# Altium schematic sheet MOSFET_V2.SchDoc
size A4; SheetNumber: 3; SheetTotal: 4
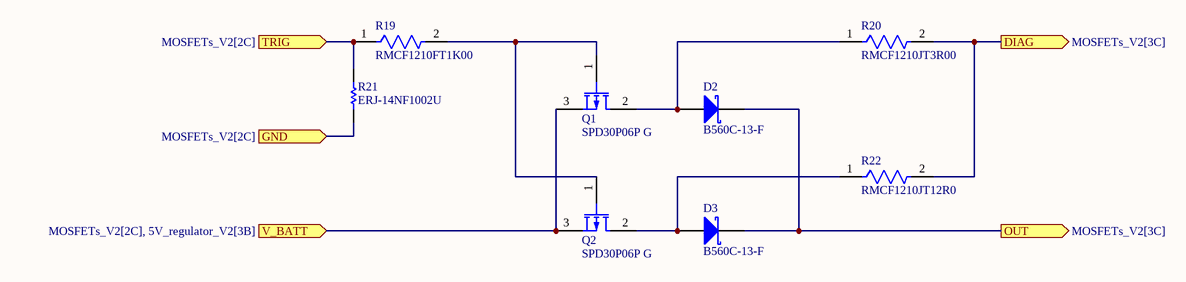
[diagram p0: MOSFET_V2.SchDoc]

## Parts
D2  B560C-13-F  [DIOD-B5X0C-2_M]
D3  B560C-13-F  [DIOD-B5X0C-2_M]
Q1  SPD30P06P G  [INF-PG-TO252-3-1_N]
Q2  SPD30P06P G  [INF-PG-TO252-3-1_N]
R19  RMCF1210FT1K00  [FP-RMCF1210-IPC_A]
R20  RMCF1210JT3R00  [FP-RMCF1210-IPC_A]
R21  ERJ-14NF1002U  [RESC3225X70X50NL20T20]
R22  RMCF1210JT12R0  [FP-RMCF1210-IPC_B]

## Ports
DIAG (out, see MOSFETs_V2[3C]), GND (in, see MOSFETs_V2[2C]), OUT (out, see MOSFETs_V2[3C]), TRIG (in, see MOSFETs_V2[2C]), V_BATT (in, see MOSFETs_V2[2C], 5V_regulator_V2[3B])

## Nets
DIAG: R20.2 R22.2 ; port DIAG
GND: R21.2 ; port GND
OUT: D2.1(K) D3.1(K) ; port OUT
TRIG: R19.1 R21.1 ; port TRIG
V_BATT: Q1.3(S) Q2.3(S) ; port V_BATT
NetD2_2: D2.2(A) Q1.2(D) R20.1
NetD3_2: D3.2(A) Q2.2(D) R22.1
NetQ1_1: Q1.1(G) Q2.1(G) R19.2

## Library data of the parts
D2 D3 = CMP-2000-05098-2: Schottky Barrier Rectifier, 5 A, 60 V, -55 to 125 degC, 2-Pin SMD, RoHS, Tape and Reel; Ir - Reverse Current: 500uA; Configuration: Single; Ifsm - Forward Surge Current: 100A; Vrrm - Repetitive Reverse Voltage: 60V; Brand: DiodesIncorporated; Vf - Forward Voltage: 0.7V; If - Forward Current: 5A; Unit Weight: 0.007408oz; Type: SchottkyBarrierRectifier; Package / Case: SMC; Manufacturer URL: http://www.diodes.com/; Datasheet URL: https://datasheet.ciiva.com/27052/1538961-27052355.pdf; Factory Pack Quantity: 3000; Height: 2.5mm; Width: 6.22mm; Product Category: SchottkyDiodes&Rectifiers; Minimum Operating Temperature: -55C; Manufacturer: DiodesIncorporated; Datasheet Version: Rev. 7-2, 06/2007; Product: SchottkyDiodes; Maximum Operating Temperature: +125C; Operating Temperature Range: -55Cto+125C; Technology: Si; Length: 7.11mm; RoHS: True; Packaging: Reel; Termination Style: SMD/SMT; Series: B560; Mounting Style: SMD/SMT
Q1 Q2 = CMP-1099-00058-1: P-Channel SIPMOS Power-Transistor, -60 V VDS, -30 A ID, -55 to 175 degC, PG-TO252-3-1, Reel, Green; Manufacturer: Infineon; Pto t (max): 125Â W; RDS (on) (max): 75Â mOhm; VGS(th) (max): -4Â V; Green: TRUE; ID (max): -30Â A; QG: 32Â nC; VDS (max): -60Â V; VGS(th) (min): -2.1Â V; RthJC (max): 1.2Â K/W; IDpuls (max): -120Â A; ComponentLink1Description: Manufacturer URL; Packing: Reel; ComponentLink2Description: Datasheet; ComponentLink1URL: http://www.infineon.com/; ComponentLink3Description: Package Specification; PackageDescription: 3-Pin Plastic (Green) Transistor Single Outline Package, 6.5 x 6.12 mm Body, 2.28 mm Pitch; Mounting Technology: Surface Mount; ComponentLink3URL: http://www.infineon.com/dgdl/TLE42744_DS_11.pdf?folderId=db3a304318f3fe290118f5a433570040&fileId=db3a304327b897500128012ccafe37d2&sId=db3a30443d67b5ca013d83f7c0ea327b; Rth: 1.2Â K/W; ComponentLink2URL: http://www.infineon.com/dgdl/SPD30P06P_Rev.2.3_pdf.pdf?folderId=db3a30431ed1d7b2011f4042f2ff4ec5&fileId=db3a30431ed1d7b2011f404fbc7e4ef4; PartNumber: SPD30P06P G; PackageReference: PG-TO252-3-1; DatasheetVersion: Rev. 2.3; PackageVersion: Jan-10
R19 = CMP-26527-007195-1: 1kΩ ±1% 0.5W 1210 Thick Film Chip Resistor AEC-Q200 compliant; Max Power Dissipation: 333mW; Temperature Coefficient: 100ppm/°C; Resistance: 1kR; Lead Free: Lead Free; Radiation Hardening: No; Min Operating Temperature: -55°C; RoHS Compliant: Yes; Length: 3.2mm; Height: 0.028inch; Contact Plating: Tin; Resistor Type: Thick Film; Case Code (Metric): 3225; Case Code (Imperial): 1210; Military Standard: Not; Tolerance: 1%; Series: RMCF; Features: Automotive AEC-Q200; Case/Package: 1210; Max Operating Temperature: 155°C; Construction: Rectangular; Number of Terminations: 2; Width: 0.098inch; Depth: 2.5mm; Mount: Surface Mount; Packaging: Tape and Reel
R20 = CMP-26527-000722-1: 3Ω ±5% 0.5W 1210 Thick Film Chip Resistor AEC-Q200 compliant; Temperature Coefficient: 400ppm/°C; Max Power Dissipation: 500mW; Resistance: 3R; Length: 0.126inch; Case/Package: 1210; Mount: Surface Mount; Resistor Type: Thick Film; Radiation Hardening: No; Tolerance: 5%; Min Operating Temperature: -55°C; Features: Automotive AEC-Q200; Max Operating Temperature: 155°C; Contact Plating: Tin; Series: RMCF; Case Code (Metric): 3225; Number of Terminations: 2; Height: 0.028inch; RoHS Compliant: Yes; Case Code (Imperial): 1210; Packaging: Tape and Reel; Width: 0.098inch
R21 = CMP-1015-00623-2: Manufacturer: Panasonic; Part Number: ERJ-14NF1002U
R22 = CMP-26527-003986-1: 12Ω ±5% 0.5W 1210 Thick Film Chip Resistor AEC-Q200 compliant; Temperature Coefficient: 200ppm/°C; Max Power Dissipation: 500mW; Resistance: 12R; Resistor Type: Thick Film; Case/Package: 1210; Tolerance: 5%; Length: 0.126inch; Height: 0.028inch; Contact Plating: Tin; Width: 0.098inch; Mount: Surface Mount; Radiation Hardening: No; Number of Terminations: 2; Min Operating Temperature: -55°C; Series: RMCF; Packaging: Tape and Reel; RoHS Compliant: Yes; Max Operating Temperature: 155°C; Features: Automotive AEC-Q200